# Altium schematic sheet LPCB281 - TOP.SchDoc
size A3; Address1: Factory 10; Address2: 9-13 Dingley Avenue, Dandeong, VICTORIA 3175, AUSTRALIA; DocumentNumber: 1; Revision: 1; SheetNumber: 1; SheetTotal: 5; Lockie__PCB_SUB_ASSEMBLY: PCB Sub Component; Lockie__PCB_ASSEMBLY: PCB Assembly; Lockie__LDL: LPCB281; Lockie__PCB_DESCRIPTION: Aux Prop Unit (APU)
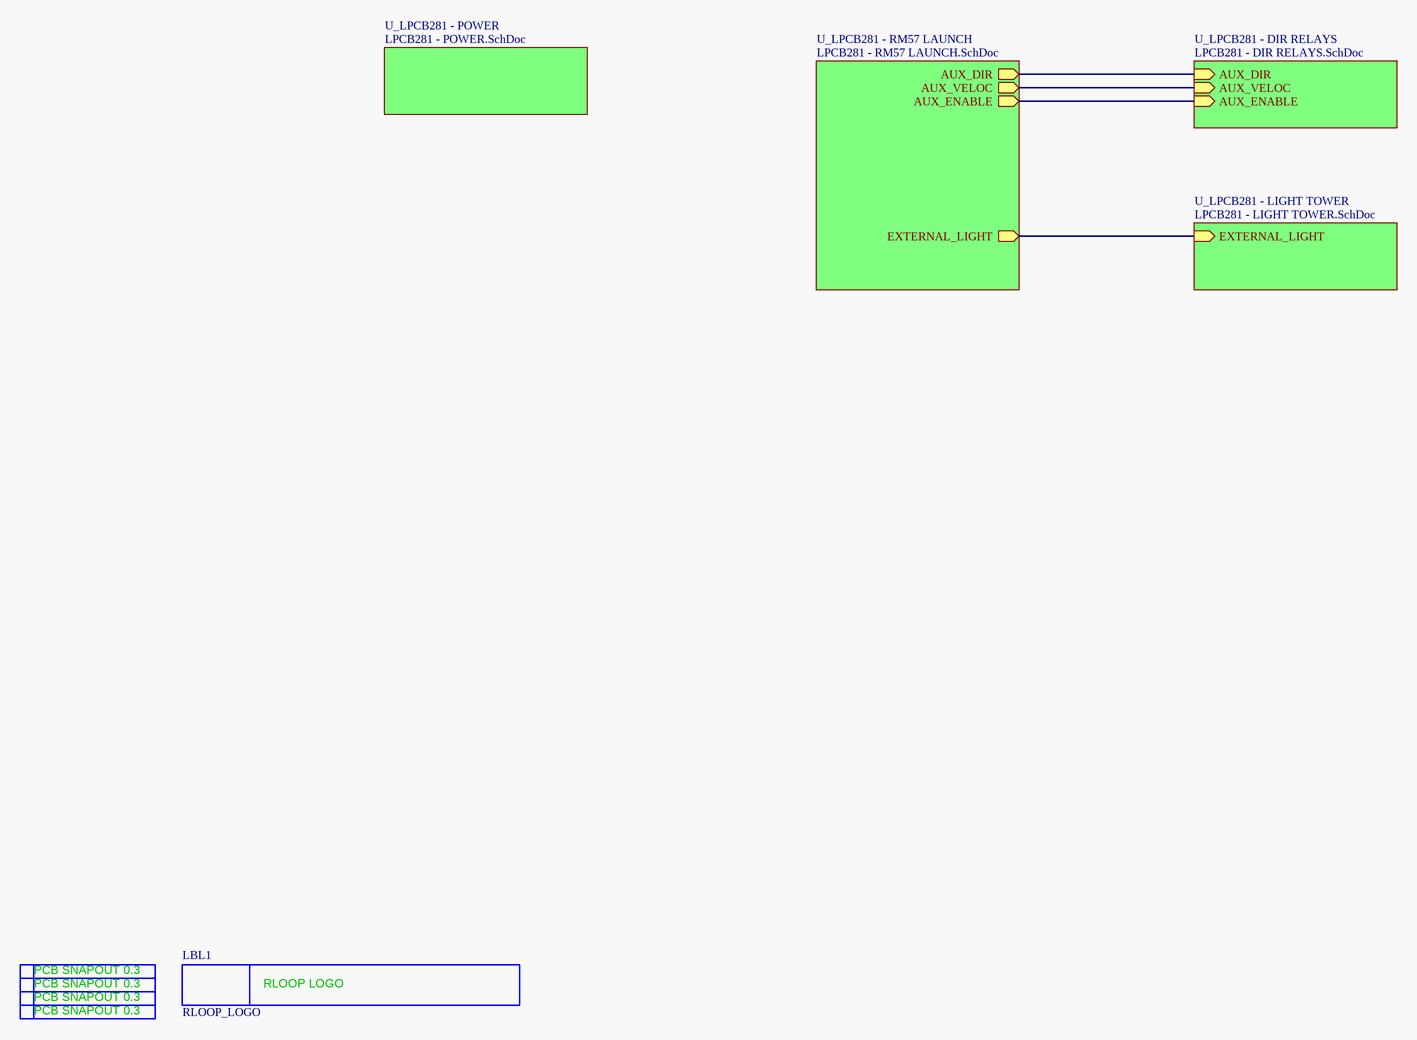
[diagram p0: LPCB281 - TOP.SchDoc]

## Parts
LBL1  RLOOP_LOGO  [RLOOP_LOGO]  (no BOM)
SN1  PCB_SNAPOUT_0.3MM  [PCB_SNAPOUT_0.3MM]  (value not drawn)  (no BOM)
SN2  PCB_SNAPOUT_0.3MM  [PCB_SNAPOUT_0.3MM]  (value not drawn)  (no BOM)
SN3  PCB_SNAPOUT_0.3MM  [PCB_SNAPOUT_0.3MM]  (value not drawn)  (no BOM)
SN4  PCB_SNAPOUT_0.3MM  [PCB_SNAPOUT_0.3MM]  (value not drawn)  (no BOM)

## Sub-sheets
U_LPCB281 - DIR RELAYS = LPCB281 - DIR RELAYS.SchDoc: AUX_DIR (in), AUX_VELOC (in), AUX_ENABLE (in)
U_LPCB281 - LIGHT TOWER = LPCB281 - LIGHT TOWER.SchDoc: EXTERNAL_LIGHT (in)
U_LPCB281 - POWER = LPCB281 - POWER.SchDoc: no entries
U_LPCB281 - RM57 LAUNCH = LPCB281 - RM57 LAUNCH.SchDoc: AUX_VELOC (out), AUX_DIR (out), AUX_ENABLE (out), EXTERNAL_LIGHT (out)

## Nets
(unnamed): sheet U_LPCB281 - RM57 LAUNCH/AUX_VELOC, sheet U_LPCB281 - DIR RELAYS/AUX_VELOC
(unnamed): sheet U_LPCB281 - RM57 LAUNCH/AUX_DIR, sheet U_LPCB281 - DIR RELAYS/AUX_DIR
(unnamed): sheet U_LPCB281 - RM57 LAUNCH/AUX_ENABLE, sheet U_LPCB281 - DIR RELAYS/AUX_ENABLE
(unnamed): sheet U_LPCB281 - RM57 LAUNCH/EXTERNAL_LIGHT, sheet U_LPCB281 - LIGHT TOWER/EXTERNAL_LIGHT

## Notes on the sheet
- PCB COMPONENT DESCRIPTION
- LDL NUMBER
- Assembly Details
- Size
- Drawing File Name
- Revision
- http://sil3.com.au
  ACN: 123 529 064
  Factory 10
  9-13 Dingley Avenue
  Dandenong, VICTORIA
  Australia
- Scale
- A3
- Sheet Details
- N.T.S
- Sheet:
- Of:
- (in symbol PCB_SNAPOUT_0.3MM) PCB SNAPOUT 0.3
- (in symbol RLOOP_LOGO) RLOOP LOGO

## Library data of the parts
LBL1 = RLOOP_LOGO: FMEDA__CHANNEL: DIAG; FMEDA__FUNCTION_IN_SYSTEM: *
SN1-SN4 = PCB_SNAPOUT_0.3MM: PCB Snapout + 0.3mm; FMEDA__CHANNEL: DIAG; FMEDA__FUNCTION_IN_SYSTEM: *